# EAGLE design bebox_nidaq_stimulus (EAGLE 9.3.2)
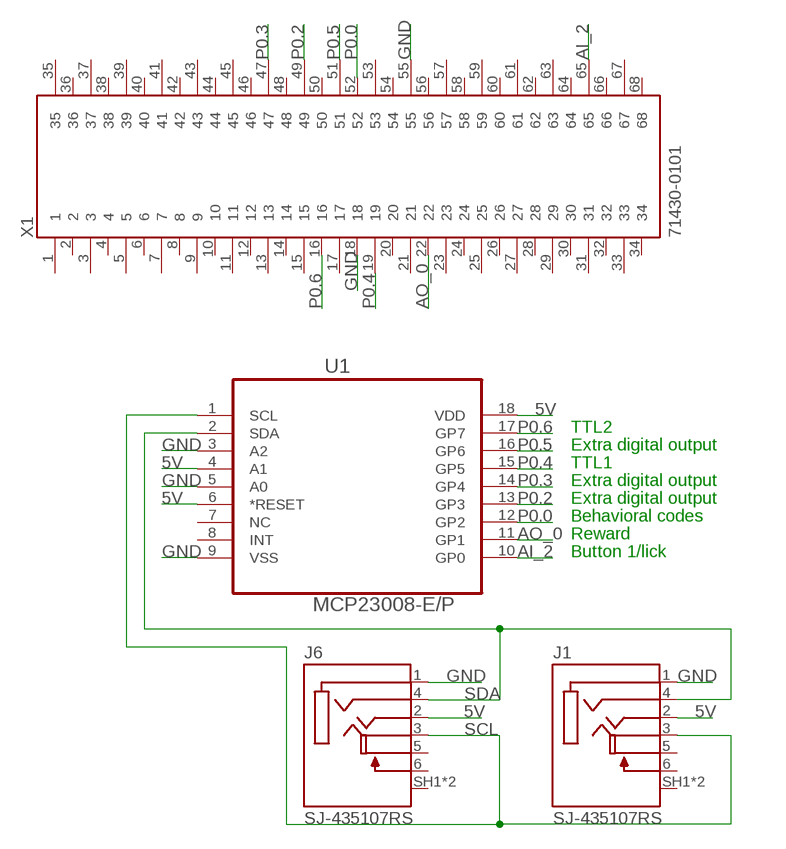
[diagram p0: schematic, sheet 1]

## Parts
J1  SJ-435107RS  [CUI_SJ-435107RS]
J6  SJ-435107RS  [CUI_SJ-435107RS]
U1  MCP23008-E/P  [DIP254P762X533-18]
X1  71430-0101  [MOLEX_71430-0101]

## Nets
5V: J1.2(TIP) J6.2(TIP) U1.4(A1) U1.6(*RESET) U1.18(VDD)
AI_2: U1.10(GP0) X1.65
AO_0: U1.11(GP1) X1.22
GND: J1.1(SLEEVE) J6.1(SLEEVE) U1.3(A2) U1.5(A0) U1.9(VSS) X1.18 X1.55
P0.0: U1.12(GP2) X1.52
P0.2: U1.13(GP3) X1.49
P0.3: U1.14(GP4) X1.47
P0.4: U1.15(GP5) X1.19
P0.5: U1.16(GP6) X1.51
P0.6: U1.17(GP7) X1.16
SCL: J1.3(RING1) J6.3(RING1) U1.1(SCL)
SDA: J1.4(RING2) J6.4(RING2) U1.2(SDA)
Unconnected: J1.5(ISOLATED_RING1) J1.6(ISOLATED_RING1_SWITCH(N-O)) J1.SH1(SHIELD) J1.SH2(SHIELD) J6.5(ISOLATED_RING1) J6.6(ISOLATED_RING1_SWITCH(N-O)) J6.SH1(SHIELD) J6.SH2(SHIELD) U1.7(NC) U1.8(INT) X1.1 X1.2 X1.3 X1.4 X1.5 X1.6 X1.7 X1.8 X1.9 X1.10 X1.11 X1.12 X1.13 X1.14 X1.15 X1.17 X1.20 X1.21 X1.23 X1.24 X1.25 X1.26 X1.27 X1.28 X1.29 X1.30 X1.31 X1.32 X1.33 X1.34 X1.35 X1.36 X1.37 X1.38 X1.39 X1.40 X1.41 X1.42 X1.43 X1.44 X1.45 X1.46 X1.48 X1.50 X1.53 X1.54 X1.56 X1.57 X1.58 X1.59 X1.60 X1.61 X1.62 X1.63 X1.64 X1.66 X1.67 X1.68

## Notes on the sheet
- TTL2
- Extra digital output
- TTL1
- Extra digital output
- Extra digital output
- Behavioral codes
- Reward
- Button 1/lick

## Library data of the parts
J1 J6 = SJ-435107RS:SJ-435107RS: 3.5 mm Right Angle Shielded (0.141", 1/8", Mini Plug) Female HeadPhone Jack; AVAILABILITY: Good; DESCRIPTION: 3.5 mm Right Angle Shielded _0.141, 1/8, Mini Plug_ Female HeadPhone Jack; MF: CUI; MP: SJ-435107RS; PACKAGE: None; PRICE: 1.04 USD
U1 = MCP23008-E_P:MCP23008-E/P: IC I/O EXPANDER I2C 8B; AVAILABILITY: Unavailable; DESCRIPTION: MCP23008 Series 5.5 V 1.7 MHz 8-Bit I/O Expander with Serial Interface - PDIP-18; MF: Microchip; MP: MCP23008-E/P; PACKAGE: PDIP-18 Microchip; PRICE: None
X1 = 71430-0101:71430-0101: 0.80mm Pitch Ultra+™ VHDCI Receptacle, Right Angle, with or without Enhanced Shield, 68 Circuits; DESCRIPTION: 0.80mm Pitch Ultra+™ VHDCI Receptacle, Right Angle, with or without Enhanced Shield, 68 Circuits; DIGI-KEY_PART_NUMBER: WM7354-ND; DIGI-KEY_PURCHASE_URL: https://www.digikey.com/product-detail/en/molex/71430-0101/WM7354-ND/1998085?utm_source=snapeda&utm_medium=aggregator&utm_campaign=symbol; MF: Molex; MP: 71430-0101; PACKAGE: None

## Board
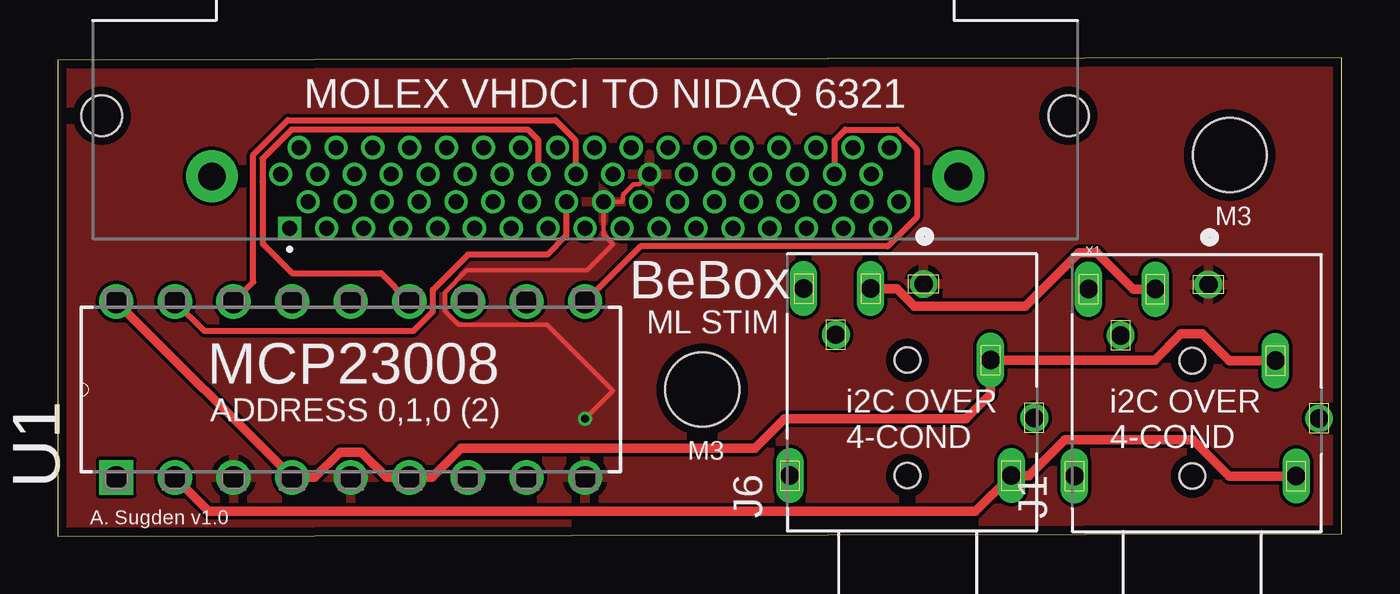
[diagram p1: board, top side]
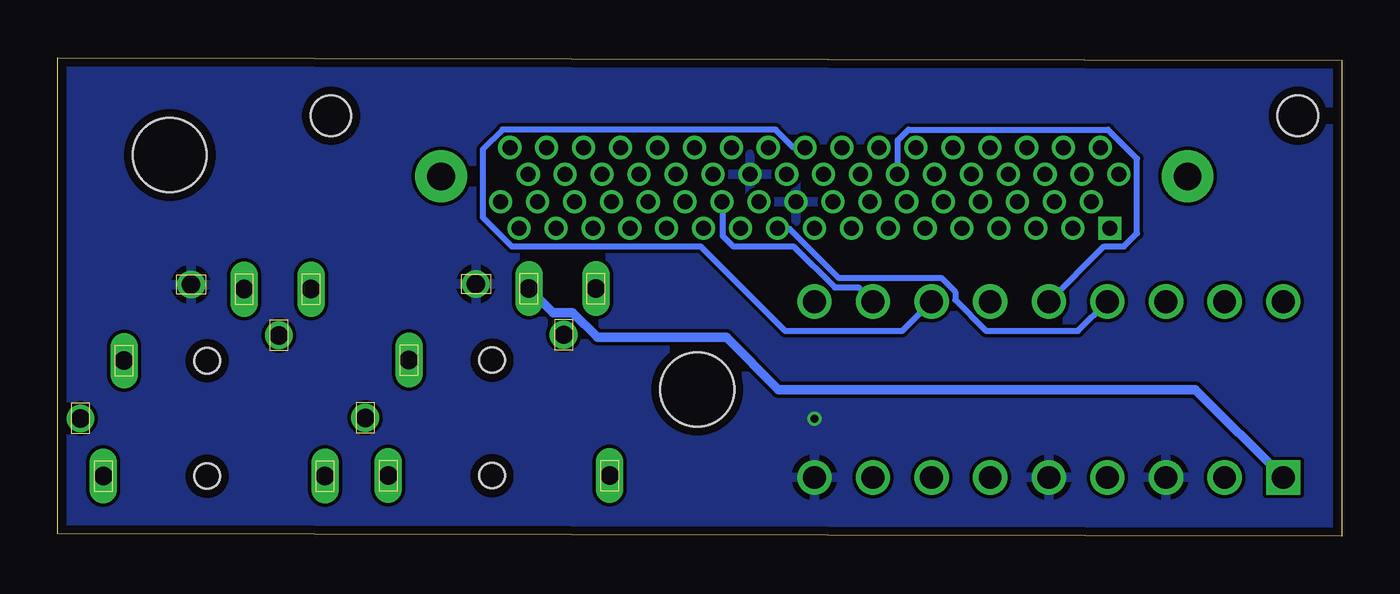
[diagram p2: board, bottom side, seen from below]

Size 55.66 x 20.73 mm. Coordinates in mm from the lower left corner, seen from the top.
Outline: 0,0 55.66,0.1 55.66,20.73 0,20.62 0,0
Copper layers (1*16): Top 0.035559375mm / dielectric 1.6mm / Bottom 0.035559375mm
Design rules "oshpark-2layer": minimum track width 6mil, minimum drill 10mil, track to track 6mil, track to pad 6mil, pad to pad 6mil, via to via 6mil, smd to smd 6mil, copper to edge 15mil, drill to drill 6mil, minimum pad ring 5mil, minimum via ring 5mil, stop-mask expansion 2.5mil, vias tented up to drill 0mil, thermal gap 10mil
Holes 3.2 mm at 27.94,6.35 50.8,16.51

### Footprints (pad centres in the part's own frame; a part is rotated, then mirrored left to right if it is on the bottom)
CUI_SJ-435107RS = drill 0.8 pad 1.1: 1 4.7,-0.7; 5 2.5,3.1; SH2 -1.1,-5.5 | drill 0.8 pad 1.1 long: 2 1.4,-3.6; 3 4.5,1.6; 4 -3.6,-4.5; 6 4.5,4.5; SH1 -3.6,5.1 | hole 1.1: -3.6,0; 1.4,0
DIP254P762X533-18 = drill 0.991 square: 1 -7.62,20.32 | drill 0.991: 2 -7.62,17.78; 3 -7.62,15.24; 4 -7.62,12.7; 5 -7.62,10.16; 6 -7.62,7.62; 7 -7.62,5.08; 8 -7.62,2.54; 9 -7.62,0; 10 0,0; 11 0,2.54; 12 0,5.08; 13 0,7.62; 14 0,10.16; 15 0,12.7; 16 0,15.24; 17 0,17.78; 18 0,20.32
MOLEX_71430-0101 = drill 0.65 pad 1 square: 1 12.8,0 | drill 0.65 pad 1: 2 12,-1.15; 3 11.2,0; 4 10.4,-1.15; 5 9.6,0; 6 8.8,-1.15; 7 8,0; 8 7.2,-1.15; 9 6.4,0; 10 5.6,-1.15; 11 4.8,0; 12 4,-1.15; 13 3.2,0; 14 2.4,-1.15; 15 1.6,0; 16 0.8,-1.15; 17 0,0; 18 -0.8,-1.15; 19 -1.6,0; 20 -2.4,-1.15; 21 -3.2,0; 22 -4,-1.15; 23 -4.8,0; 24 -5.6,-1.15; 25 -6.4,0; 26 -7.2,-1.15; 27 -8,0; 28 -8.8,-1.15; 29 -9.6,0; 30 -10.4,-1.15; 31 -11.2,0; 32 -12,-1.15; 33 -12.8,0; 34 -13.6,-1.15; 35 13.2,-2.35; 36 12.4,-3.5; 37 11.6,-2.35; 38 10.8,-3.5; 39 10,-2.35; 40 9.2,-3.5; 41 8.4,-2.35; 42 7.6,-3.5; 43 6.8,-2.35; 44 6,-3.5; 45 5.2,-2.35; 46 4.4,-3.5; 47 3.6,-2.35; 48 2.8,-3.5; 49 2,-2.35; 50 1.2,-3.5; 51 0.4,-2.35; 52 -0.4,-3.5; 53 -1.2,-2.35; 54 -2,-3.5; 55 -2.8,-2.35; 56 -3.6,-3.5; 57 -4.4,-2.35; 58 -5.2,-3.5; 59 -6,-2.35; 60 -6.8,-3.5; 61 -7.6,-2.35; 62 -8.4,-3.5; 63 -9.2,-2.35; 64 -10,-3.5; 65 -10.8,-2.35; 66 -11.6,-3.5; 67 -12.4,-2.35; 68 -13.2,-3.5 | drill 1.2 pad 2.25: 69 -16.175,-2.25; 70 16.175,-2.25 | hole 1.75: -20.95,-4.88; 20.95,-4.88

### Placement (x,y rotation side)
J1  49.17,6.2 90 top
J6  36.83,6.22 90 top
U1  22.86,10.16 90 top
X1  22.86,13.34 180 top

### Tracks (layer width: path | path; a pad name or v marks a point on that pad's centre or on a via)
5V
  Top 0.406: U1.18 U1.4 11.15,2.54 12.24,3.64 13.15,3.64 14.25,2.54 U1.6 16.23,2.54 17.48,3.8 30.21,3.8 31.5,5.08 39.37,5.08 40.43,6.14 J6.2 47.55,7.62 48.68,8.76 49.62,8.76 50.78,7.6 J1.2
AI_2
  Top 0.254: X1.65 33.68,15.71 33.68,17.16 34.14,17.61 36.38,17.61 37.24,16.76 37.24,13.81 35.98,12.56 25.26,12.56 U1.10
AO_0
  Bottom 0.254: U1.11 20.94,10.78 21.98,10.78 23.76,12.56 26.38,12.56 26.84,13.01 26.84,14.46 X1.22
GND  (via drill 0.35)
  Top 0.203: X1.55 25.21,15.24 24.95,15.24 24.51,14.8 24.51,14.53 24.46,14.48 X1.18 23.66,13.07 24.08,12.65 22.94,11.51 17.72,11.51 16.78,10.57 16.78,9.75 17.37,9.16 21.22,9.16 24.08,6.3 v22.86,5.08
  pour Bottom: -1.27,21.59 -1.27,-1.27 57.15,-1.27 57.15,21.59
  pour Top: -1.27,21.59 -1.27,-1.27 57.15,-1.27 57.15,21.59
P0.0
  Bottom 0.254: X1.52 23.76,16.84 24.54,17.61 36.38,17.61 37.24,16.76 37.24,13.81 35.98,12.56 27.8,12.56 24.13,8.89 19.05,8.89 U1.12
P0.2
  Top 0.254: U1.13 14.01,11.39 10.16,11.39 8.89,12.66 8.89,15.35 8.88,15.36 8.88,16.36 10.14,17.61 20.38,17.61 20.84,17.16 20.84,15.71 X1.49
P0.3
  Bottom 0.254: X1.47 19.24,15.71 19.24,17.16 18.78,17.61 10.14,17.61 8.88,16.36 8.88,13.12 9.1,12.9 9.44,12.56 10.3,12.56 U1.14
P0.4
  Bottom 0.254: U1.15 11.43,8.89 15.42,8.89 16.76,10.23 16.76,10.58 17.36,11.18 21.81,11.18 23.96,13.34 X1.19
P0.5
  Top 0.254: U1.16 8.47,11.01 8.47,16.53 9.97,18.02 21.58,18.02 22.44,17.16 22.44,15.71 X1.51
P0.6
  Top 0.254: U1.17 6.35,8.89 15.42,8.89 16.26,9.74 16.26,10.68 17.78,12.2 21.22,12.2 22.04,13.01 22.04,14.46 X1.16
SCL
  Top 0.406: J6.3 36.38,10.72 37.13,9.97 41.94,9.97 44.25,12.28 45.05,12.28 46.63,10.7 J1.3
  Bottom 0.406: J6.3 34.19,9.68 33.33,9.68 32.27,8.61 26.67,8.61 24.41,6.35 6.35,6.35 U1.1
SDA
  Top 0.406: U1.2 6.55,1.07 39.77,1.07 J6.4 42.1,2.62 43.65,4.18 49.2,4.18 50.78,2.6 J1.4

### Text on the board
tPlace: MOLEX VHDCI TO NIDAQ 6321 | M3 | BeBox | ML STIM | MCP23008 | ADDRESS 0,1,0 (2) | i2C OVER / 4-COND | i2C OVER / 4-COND | M3 | A. Sugden v1.0